# Altium project Compressor.PrjPcb (part 1 of 4)
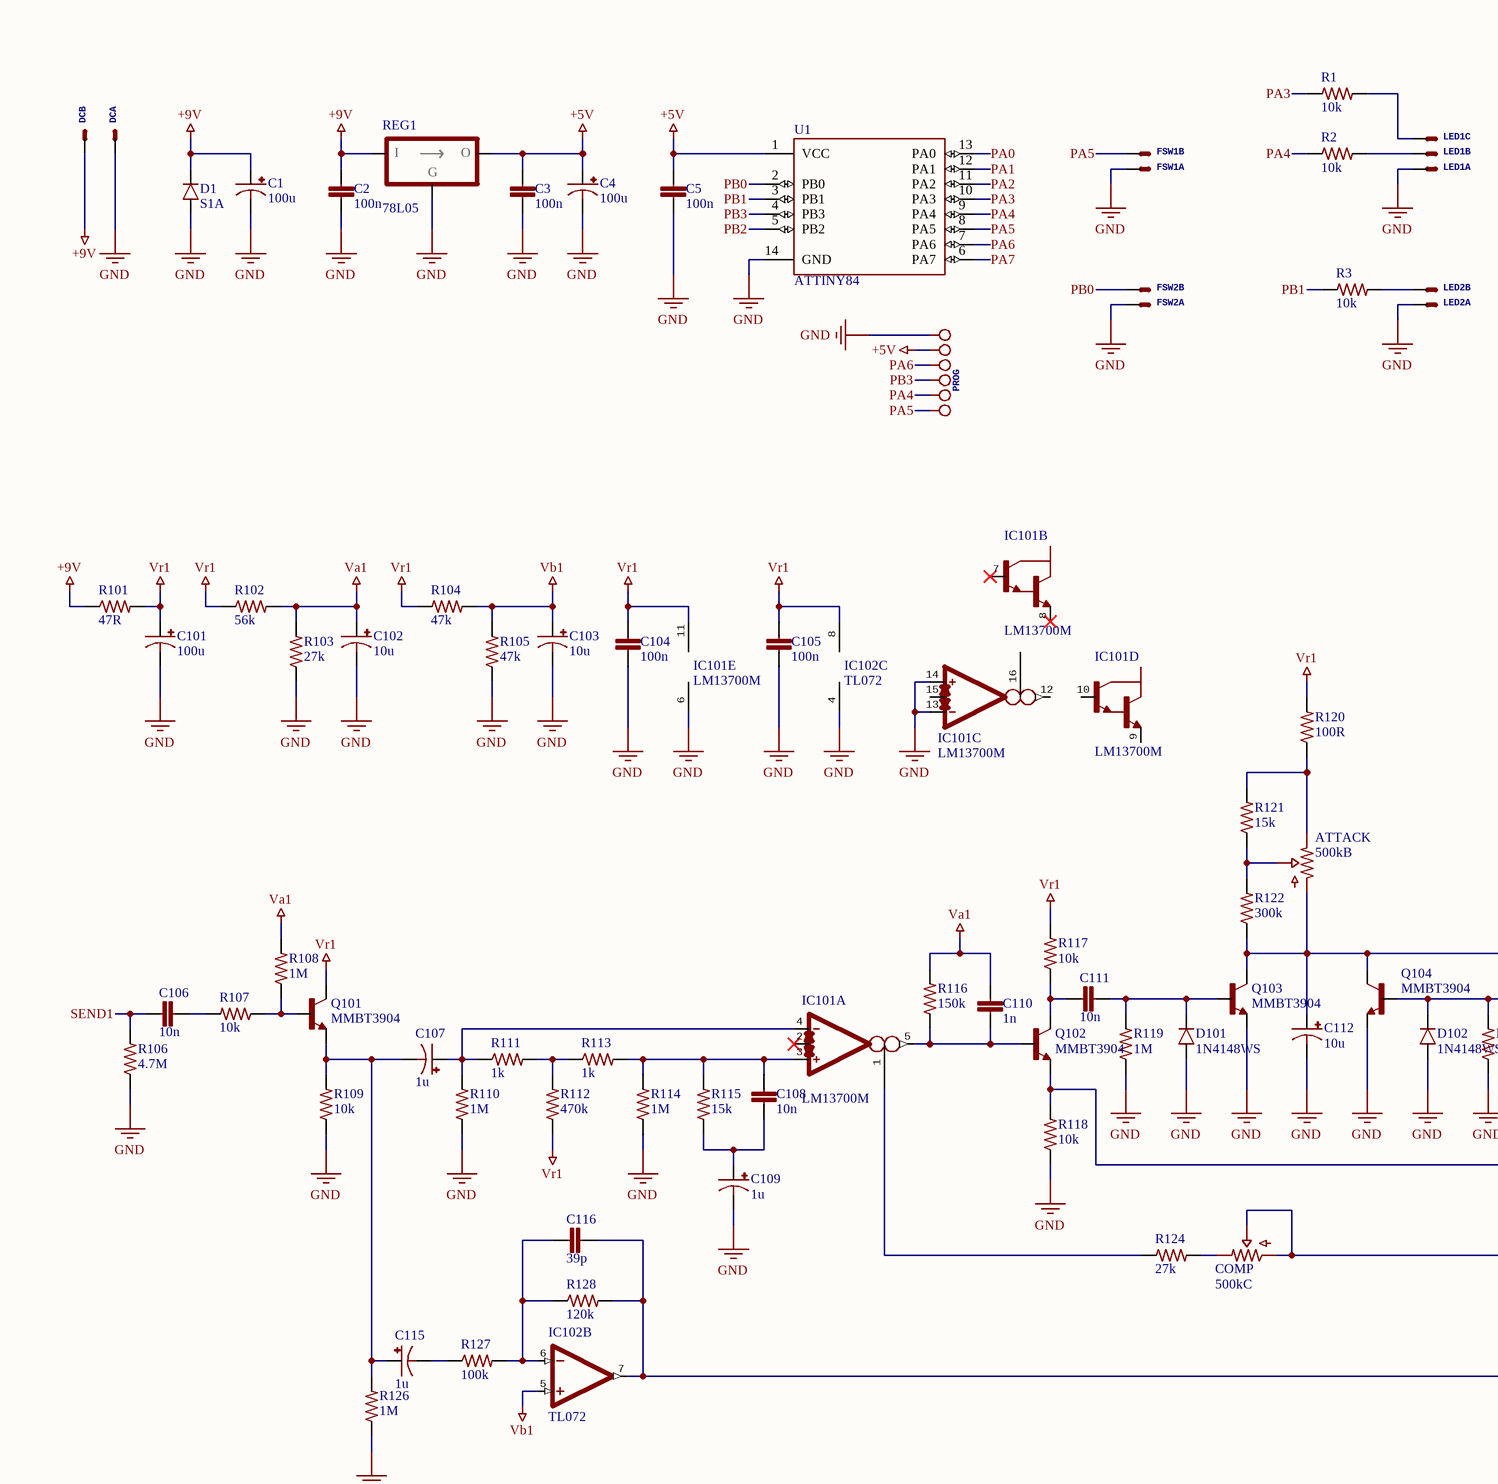
[diagram p0: Compressor.SchDoc, top left]
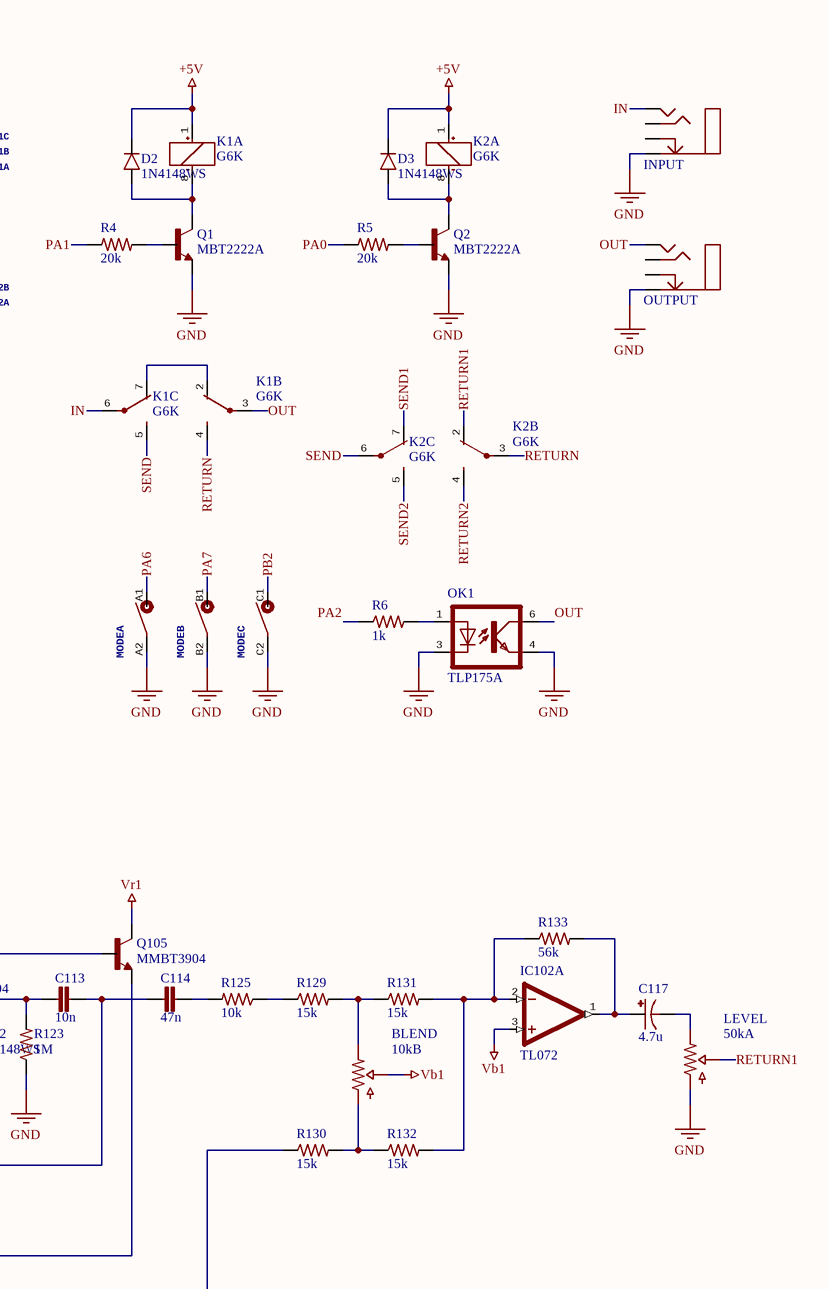
[diagram p1: Compressor.SchDoc, top right]
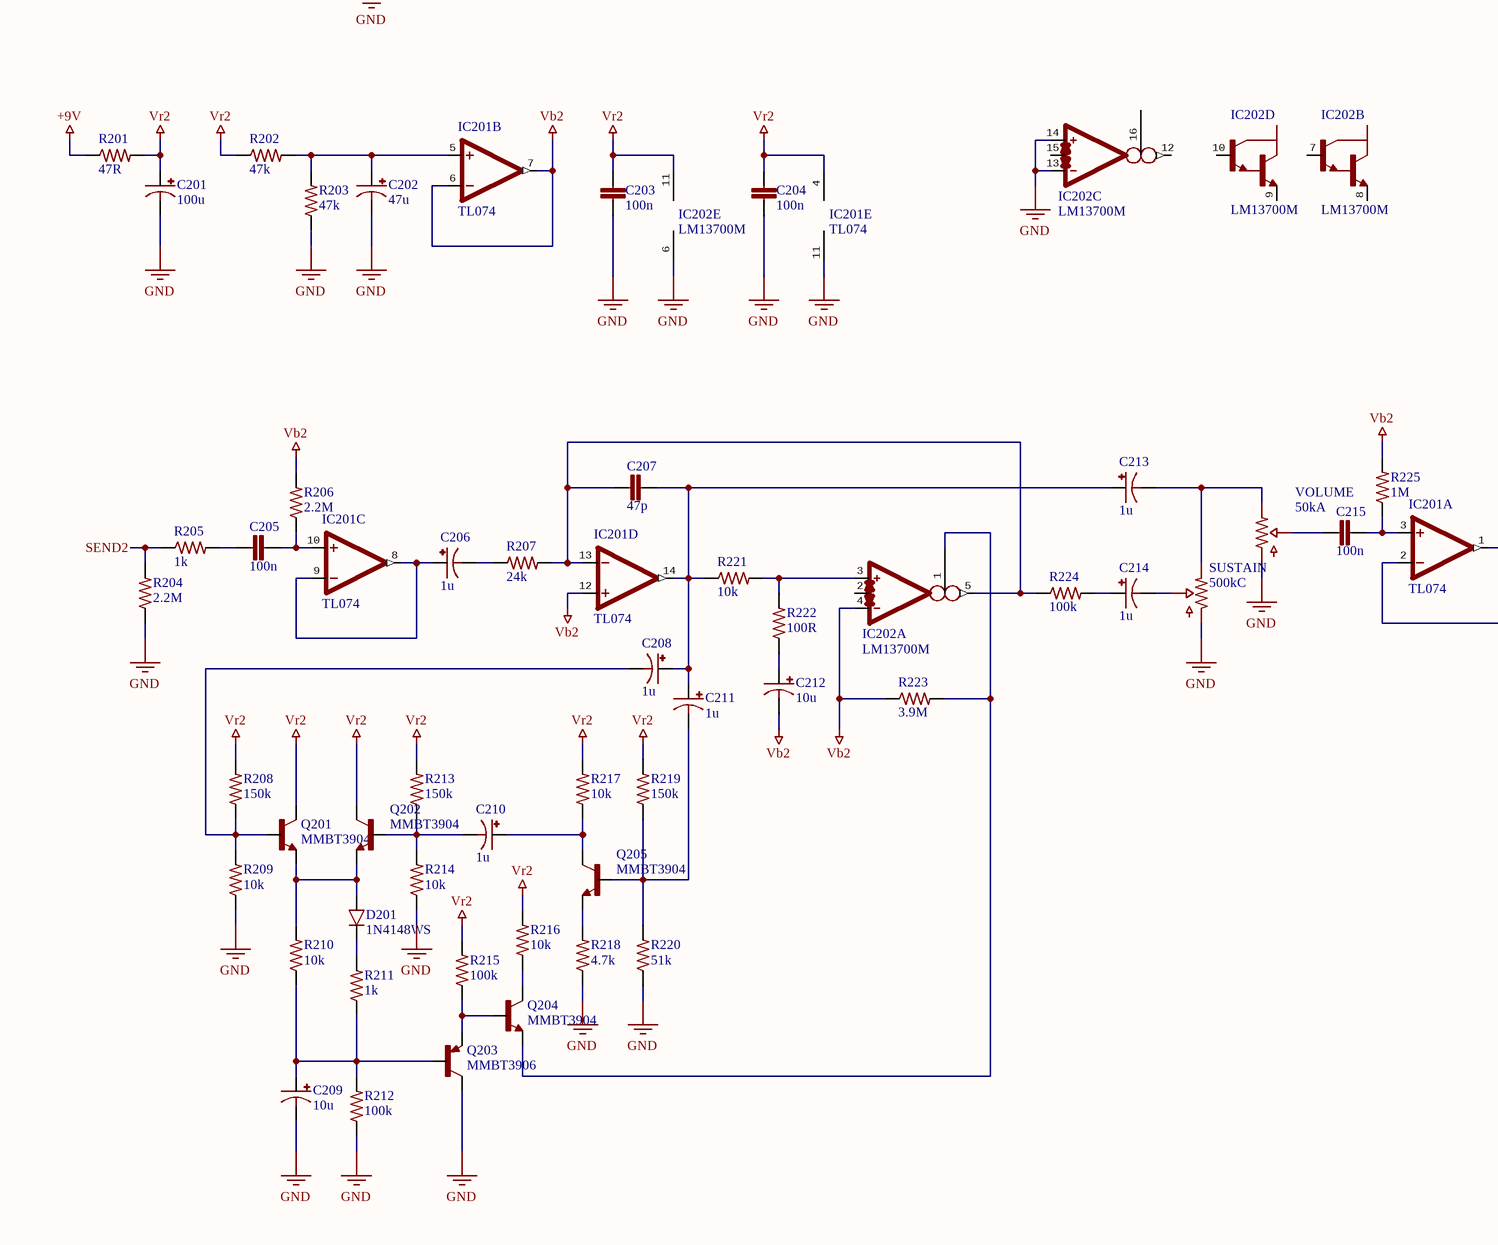
[diagram p2: Compressor.SchDoc, bottom left]
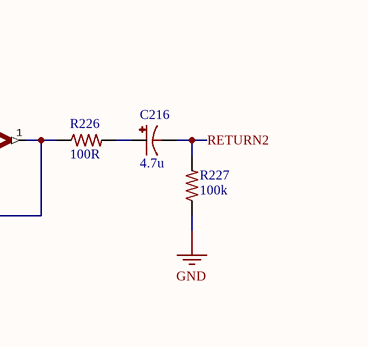
[diagram p3: Compressor.SchDoc, bottom right]
1 sheet, 146 parts. Net scope: global (net labels, ports and power ports of the same name join across sheets).
Board file: Compressor.PcbDoc

## Sheet Compressor.SchDoc
size E

### Parts
ATTACK  500kB  [ALPHA_9MM_TOP_NOMH]
BLEND  10kB  [ALPHA_9MM_TOP_NOMH]
C1  100u  [CAPAE_D]
C2  100n  [CHIP_0603]
C3  100n  [CHIP_0603]
C4  100u  [CAPAE_D]
C5  100n  [CHIP_0603]
C101  100u  [CAPAE_D]
C102  10u  [CAPAE_B]
C103  10u  [CAPAE_B]
C104  100n  [CHIP_0603]
C105  100n  [CHIP_0603]
C106  10n  [CHIP_0603]
C107  1u  [CAPAE_B]
C108  10n  [CHIP_0603]
C109  1u  [TAN_1206]
C110  1n  [CHIP_0603]
C111  10n  [CHIP_0603]
C112  10u  [TAN_1206]
C113  10n  [CHIP_0603]
C114  47n  [CHIP_1206]
C115  1u  [CAPAE_B]
C116  39p  [CHIP_0603]
C117  4.7u  [CAPAE_C]
C201  100u  [CAPAE_D]
C202  47u  [CAPAE_D]
C203  100n  [CHIP_0603]
C204  100n  [CHIP_0603]
C205  100n  [CHIP_1206]
C206  1u  [CAPAE_B]
C207  47p  [CHIP_0603]
C208  1u  [CAPAE_B]
C209  10u  [TAN_1206]
C210  1u  [CAPAE_B]
C211  1u  [CAPAE_B]
C212  10u  [TAN_1206]
C213  1u  [CAPAE_B]
C214  1u  [CAPAE_B]
C215  100n  [CHIP_1206]
C216  4.7u  [CAPAE_C]
COMP  500kC  [ALPHA_9MM_TOP_NOMH]
D1  S1A  [DO214]
D2  1N4148WS  [SOD323]
D3  1N4148WS  [SOD323]
D101  1N4148WS  [SOD323]
D102  1N4148WS  [SOD323]
D201  1N4148WS  [SOD323]
DC  J_JST-XH-02  [JST-XH-02]  (value not drawn)  (parts A,B of 2)
FSW1  (no value)  [JST-XH-02]  (parts A,B of 2)
FSW2  (no value)  [JST-XH-02]  (parts A,B of 2)
IC101  LM13700M  [SO-16]  (parts A,B,C,D,E of 5)
IC102  TL072  [SO-8]  (parts A,B,C of 3)
IC201  TL074  [SO-14]  (parts A,B,C,D,E of 5)
IC202  LM13700M  [SO-16]  (parts A,B,C,D,E of 5)
INPUT  J_STEREO  [STEREO]  (value not drawn)
K1  G6K  [G6K]  (parts A,B,C of 3)
K2  G6K  [G6K]  (parts A,B,C of 3)
LED1  J_JST-XH-03  [JST-XH-03]  (value not drawn)  (parts A,B,C of 3)
LED2  (no value)  [JST-XH-02]  (parts A,B of 2)
LEVEL  50kA  [ALPHA_9MM_TOP_NOMH]
MODE  DIP  [DIP_3WAY]  (value not drawn)  (parts A,B,C of 3)
OK1  TLP175A  [TLP175A]
OUTPUT  J_STEREO  [STEREO]  (value not drawn)
PROG  J_HEADER_6PINS_FEM  [HEADER_6Pins_FEM]  (value not drawn)
Q1  MBT2222A  [SOT323]
Q2  MBT2222A  [SOT323]
Q101  MMBT3904  [SOT23]
Q102  MMBT3904  [SOT23]
Q103  MMBT3904  [SOT23]
Q104  MMBT3904  [SOT23]
Q105  MMBT3904  [SOT23]
Q201  MMBT3904  [SOT23]
Q202  MMBT3904  [SOT23]
Q203  MMBT3906  [SOT23]
Q204  MMBT3904  [SOT23]
Q205  MMBT3904  [SOT23]
R1  10k  [CHIP_R_1206]
R2  10k  [CHIP_R_1206]
R3  10k  [CHIP_R_1206]
R4  20k  [CHIP_R_0603]
R5  20k  [CHIP_R_0603]
R6  1k  [CHIP_R_0603]
R101  47R  [CHIP_R_1206]
R102  56k  [CHIP_R_1206]
R103  27k  [CHIP_R_1206]
R104  47k  [CHIP_R_1206]
R105  47k  [CHIP_R_1206]
R106  4.7M  [CHIP_R_0603]
R107  10k  [CHIP_R_0603]
R108  1M  [CHIP_R_0603]
R109  10k  [CHIP_R_0603]
R110  1M  [CHIP_R_0603]
R111  1k  [CHIP_R_0603]
R112  470k  [CHIP_R_0603]
R113  1k  [CHIP_R_0603]
R114  1M  [CHIP_R_0603]
R115  15k  [CHIP_R_0603]
R116  150k  [CHIP_R_0603]
R117  10k  [CHIP_R_0603]
R118  10k  [CHIP_R_0603]
R119  1M  [CHIP_R_0603]
R120  100R  [CHIP_R_0603]
R121  15k  [CHIP_R_0603]
R122  300k  [CHIP_R_0603]
R123  1M  [CHIP_R_0603]
R124  27k  [CHIP_R_0603]
R125  10k  [CHIP_R_0603]
R126  1M  [CHIP_R_0603]
R127  100k  [CHIP_R_0603]
R128  120k  [CHIP_R_0603]
R129  15k  [CHIP_R_0603]
R130  15k  [CHIP_R_0603]
R131  15k  [CHIP_R_0603]
R132  15k  [CHIP_R_0603]
R133  56k  [CHIP_R_0603]
R201  47R  [CHIP_R_1206]
R202  47k  [CHIP_R_1206]
R203  47k  [CHIP_R_1206]
R204  2.2M  [CHIP_R_0603]
R205  1k  [CHIP_R_0603]
R206  2.2M  [CHIP_R_0603]
R207  24k  [CHIP_R_0603]
R208  150k  [CHIP_R_0603]
R209  10k  [CHIP_R_0603]
R210  10k  [CHIP_R_0603]
R211  1k  [CHIP_R_0603]
R212  100k  [CHIP_R_0603]
R213  150k  [CHIP_R_0603]
R214  10k  [CHIP_R_0603]
R215  100k  [CHIP_R_0603]
R216  10k  [CHIP_R_0603]
R217  10k  [CHIP_R_0603]
R218  4.7k  [CHIP_R_0603]
R219  150k  [CHIP_R_0603]
R220  51k  [CHIP_R_0603]
R221  10k  [CHIP_R_0603]
R222  100R  [CHIP_R_0603]
R223  3.9M  [CHIP_R_0603]
R224  100k  [CHIP_R_0603]
R225  1M  [CHIP_R_0603]
R226  100R  [CHIP_R_0603]
R227  100k  [CHIP_R_0603]
REG1  78L05  [SOT23-3]
SUSTAIN  500kC  [ALPHA_9MM_TOP_NOMH]
U1  ATTINY84  [SO-14]
VOLUME  50kA  [ALPHA_9MM_TOP_NOMH]

### Nets
+5V: C3.1 C4.+ C5.1 D2.1 D3.1 K1.1(+) K2.1(+) PROG.5 REG1.1(OUTPUT) U1.1(VCC)
+9V: C1.+ C2.1 D1.1 DC.1(S) R101.1 R201.1 REG1.2(INPUT)
GND: C1.- C2.2 C3.2 C4.- C5.2 C101.- C102.- C103.- C104.2 C105.2 C109.- C112.- C201.- C202.- C203.2 C204.2 C209.- D1.2 D101.2 D102.2 DC.2(S) FSW1.2(S) FSW2.2(S) IC101.6(V-) IC101.13(IN_N) IC101.14(IN_P) IC102.4(V-) IC201.11(V-) IC202.6(V-) IC202.13(IN_N) IC202.14(IN_P) INPUT.S LED1.1(S) LED2.2(S) LEVEL.1 MODE.A2 MODE.B2 MODE.C2 OK1.3(C) OK1.4(EMIT) OUTPUT.S PROG.6 Q1.2(E) Q2.2(E) Q103.2(E) Q104.2(E) Q203.3(C) R103.1 R105.1 R106.1 R109.1 R110.1 R114.1 R118.1 R119.1 R123.1 R126.1 R203.1 R204.1 R209.1 R212.1 R214.1 R218.1 R220.1 R227.1 REG1.3(COMMON) SUSTAIN.1 U1.14(GND) VOLUME.1
Va1: C102.+ C110.1 R102.2 R103.2 R108.2 R116.2
Vb1: BLEND.2 C103.+ IC102.3(+IN) IC102.5(+IN) R104.2 R105.2
Vb2: C212.- IC201.6(-IN) IC201.7(OUT) IC201.12(+IN) IC202.4(IN_N) R206.2 R223.1 R225.2
Vr1: C101.+ C104.1 C105.1 IC101.11(V+) IC102.8(V+) Q101.3(C) Q105.3(C) R101.2 R102.1 R104.1 R112.1 R117.2 R120.2
Vr2: C201.+ C203.1 C204.1 IC201.4(V+) IC202.11(V+) Q201.3(C) Q202.3(C) R201.2 R202.1 R208.2 R213.2 R215.2 R216.2 R217.2 R219.2
IN: INPUT.T K1.6(P)
OUT: K1.3(P) OK1.6(COL) OUTPUT.T
PA0: R5.1 U1.13(PA0)
PA1: R4.1 U1.12(PA1)
PA2: R6.1 U1.11(PA2)
PA3: R1.1 U1.10(PA3)
PA4: PROG.2 R2.1 U1.9(PA4)
PA5: FSW1.1(S) PROG.1 U1.8(PA5)
PA6: MODE.A1 PROG.4 U1.7(PA6)
PA7: MODE.B1 U1.6(PA7)
PB0: FSW2.1(S) U1.2(PB0)
PB1: R3.1 U1.3(PB1)
PB2: MODE.C1 U1.5(PB2)
PB3: PROG.3 U1.4(PB3)
RETURN: K1.4(S) K2.3(P)
RETURN1: K2.2(O) LEVEL.2
RETURN2: C216.- K2.4(S) R227.2
SEND: K1.5(S) K2.6(P)
SEND1: C106.2 K2.7(O) R106.2
SEND2: K2.5(S) R204.2 R205.1
NetATTACK_1: ATTACK.1 C112.+ Q103.3(C) Q104.3(C) Q105.1(B) R122.1
NetATTACK_2: ATTACK.2 R121.1 R122.2
NetATTACK_3: ATTACK.3 R120.1 R121.2
NetBLEND_1: BLEND.1 R130.2 R132.1
NetBLEND_3: BLEND.3 R129.2 R131.1
NetC106_1: C106.1 R107.2
NetC107_+: C107.+ IC101.4(IN_N) R110.2 R111.1
NetC107_-: C107.- C115.+ Q101.2(E) R109.2 R126.2
NetC108_1: C108.1 IC101.3(IN_P) R113.2 R114.2 R115.2
NetC108_2: C108.2 C109.+ R115.1
NetC110_2: C110.2 IC101.5(OUT) Q102.1(B) R116.1
NetC111_1: C111.1 D101.1 Q103.1(B) R119.2
NetC111_2: C111.2 Q102.3(C) R117.1
NetC113_1: C113.1 C114.2 Q102.2(E) R118.2
NetC113_2: C113.2 D102.1 Q104.1(B) R123.2
NetC114_1: C114.1 R125.2
NetC115_-: C115.- R127.1
NetC116_1: C116.1 IC102.7(OUT) R128.2 R130.1
NetC116_2: C116.2 IC102.6(-IN) R127.2 R128.1
NetC117_+: C117.+ IC102.1(OUT) R133.2
NetC117_-: C117.- LEVEL.3
NetC202_+: C202.+ IC201.5(+IN) R202.2 R203.2
NetC205_1: C205.1 IC201.10(+IN) R206.1
NetC205_2: C205.2 R205.2
NetC206_+: C206.+ IC201.8(OUT) IC201.9(-IN)
NetC206_-: C206.- R207.1
NetC207_1: C207.1 C208.+ C211.+ C213.+ IC201.14(OUT) R221.1
NetC207_2: C207.2 IC201.13(-IN) IC202.5(OUT) R207.2 R224.1
NetC208_-: C208.- Q201.1(B) R208.1 R209.2
NetC209_+: C209.+ Q203.1(B) R210.1 R211.1 R212.2
NetC210_+: C210.+ Q205.3(C) R217.1
NetC210_-: C210.- Q202.1(B) R213.1 R214.2
NetC211_-: C211.- Q205.1(B) R219.1 R220.2
NetC212_+: C212.+ R222.1
NetC213_-: C213.- SUSTAIN.3 VOLUME.3
NetC214_+: C214.+ R224.2
NetC214_-: C214.- SUSTAIN.2
NetC215_1: C215.1 IC201.3(+IN) R225.1
NetC215_2: C215.2 VOLUME.2
NetC216_+: C216.+ R226.2
NetCOMP_1: COMP.1 COMP.2 Q105.2(E)
NetCOMP_3: COMP.3 R124.2
NetD2_2: D2.2 K1.8(-) Q1.3(C)
NetD3_2: D3.2 K2.8(-) Q2.3(C)
NetD201_1: D201.1 R211.2
NetD201_2: D201.2 Q201.2(E) Q202.2(E) R210.2
NetIC101_1: IC101.1(I_BIAS) R124.1
NetIC102_2: IC102.2(-IN) R131.2 R132.2 R133.1
NetIC201_1: IC201.1(OUT) IC201.2(-IN) R226.1
NetIC202_1: IC202.1(I_BIAS) Q204.2(E) R223.2
NetIC202_3: IC202.3(IN_P) R221.2 R222.2
NetK1_2: K1.2(O) K1.7(O)
NetLED1_2: LED1.2(S) R2.2
NetLED1_3: LED1.3(S) R1.2
NetLED2_1: LED2.1(S) R3.2
NetOK1_1: OK1.1(A) R6.2
NetQ1_1: Q1.1(B) R4.2
NetQ2_1: Q2.1(B) R5.2
NetQ101_1: Q101.1(B) R107.1 R108.1
NetQ203_2: Q203.2(E) Q204.1(B) R215.1
NetQ204_3: Q204.3(C) R216.1
NetQ205_2: Q205.2(E) R218.2
NetR111_2: R111.2 R112.2 R113.1
NetR125_1: R125.1 R129.1

Not connected (* = marked no-connect by the designer): IC101 2(I_DIODE)* 7(B)* 8(E)* 9(E) 10(B) 12(OUT) 15(I_DIODE) 16(I_BIAS); IC202 2(I_DIODE) 7(B) 8(E) 9(E) 10(B) 12(OUT) 15(I_DIODE) 16(I_BIAS); INPUT R SN; OUTPUT R SN